# Altium project Surf_RF_transceiver.PrjPcb
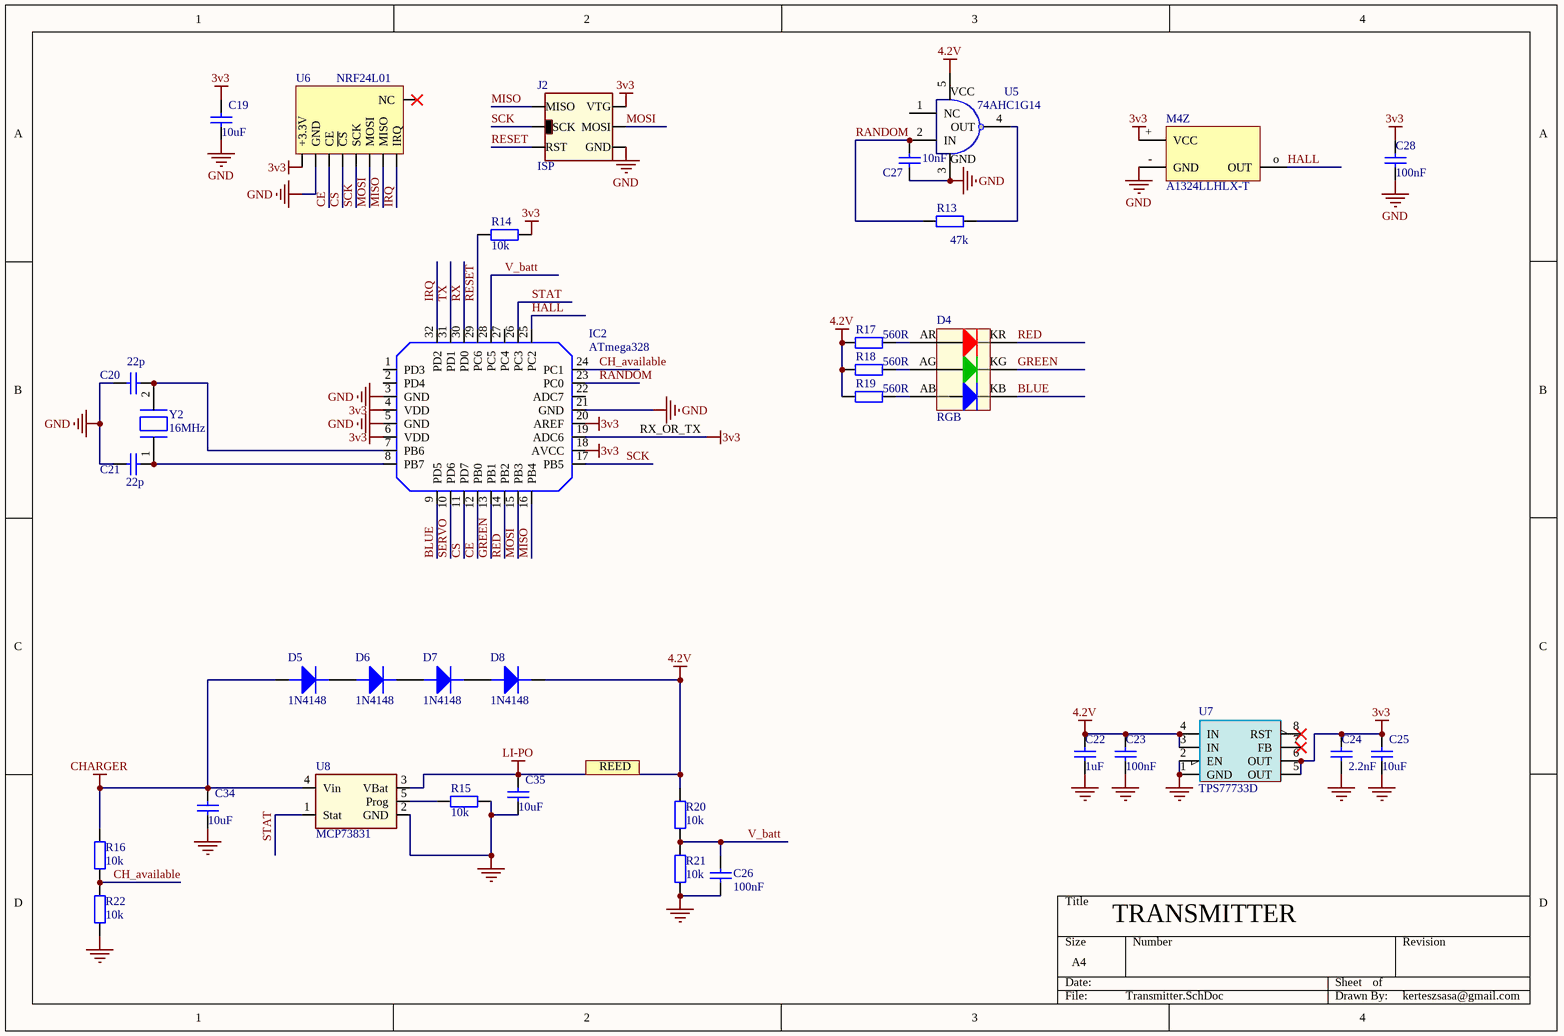
[diagram p0: Transmitter.SchDoc]
2 sheets, 76 parts. Net scope: global (net labels, ports and power ports of the same name join across sheets).
Board file: Surf_RF_transceiver.PcbDoc
Sheets:
  Transmitter.SchDoc
  Receiver.SchDoc

## Sheet Transmitter.SchDoc
size A4

### Parts
C19  10uF  [FP_0603_CAP_080]
C20  22p  [FP_0603_CAP_080]
C21  22p  [FP_0603_CAP_080]
C22  1uF  [FP_0603_CAP_080]
C23  100nF  [FP_0603_CAP_080]
C24  2.2nF  [FP_0603_CAP_080]
C25  10uF  [FP_0603_CAP_080]
C26  100nF  [FP_0603_CAP_080]
C27  10nF  [FP_0603_CAP_080]
C28  100nF  [FP_0603_CAP_080]
C34  10uF  [FP_0603_CAP_080]
C35  10uF  [FP_0603_CAP_080]
D4  RGB  [RGB_LED_5.0x5.0mm]
D5  1N4148  [SOD-80]
D6  1N4148  [SOD-80]
D7  1N4148  [SOD-80]
D8  1N4148  [SOD-80]
IC2  ATmega328  [TQFP32_N]
J2  ISP  [AVR_ISP]  (no BOM)
M4Z  A1324LLHLX-T  [Sensoe_hall_SOT23]
R13  47k  [FP_0603_RES]
R14  10k  [FP_0603_RES]
R15  10k  [FP_0603_RES]
R16  10k  [FP_0603_RES]
R17  560R  [FP_0603_RES]
R18  560R  [FP_0603_RES]
R19  560R  [FP_0603_RES]
R20  10k  [FP_0603_RES]
R21  10k  [FP_0603_RES]
R22  10k  [FP_0603_RES]
U5  74AHC1G14  [GATE_SOT23-5]
U6  NRF24L01  [NRF24L01_SMD]
U7  TPS77733D  [DIGITAL_SOIC8]
U8  MCP73831  [SUPPLY_SOT23-5]
Y2  16MHz  [FP_CRYSTAL_HC49_SMD]

### Nets
3v3: C19.2 C24.2 C25.2 C28.2 IC2.4(VDD) IC2.6(VDD) IC2.18(AVCC) IC2.19(ADC6) IC2.20(AREF) J2.2(VTG) M4Z.+(VCC) R14.2 U6.1(+3.3V) U7.5(OUT) U7.6(OUT)
4.2V: C22.2 C23.2 D8.K R17.2 R18.2 R19.2 R20.2 U5.5(VCC) U7.3(IN) U7.4(IN)
CHARGER: C34.2 D5.A R16.2 U8.4(Vin)
GND: C19.1 C20.1 C21.1 C22.1 C23.1 C24.1 C25.1 C26.2 C27.1 C28.1 C34.1 C35.1 IC2.3(GND) IC2.5(GND) IC2.21(GND) J2.6(GND) M4Z.-(GND) R15.1 R21.1 R22.1 U5.3(GND) U6.2(GND) U7.1(GND) U7.2(EN) U8.2(GND)
LI-PO: C35.2 U8.3(VBat)
BLUE: D4.KB(R) IC2.9(PD5)
CE: IC2.12(PB0) U6.3(CE)
CH_available: IC2.24(PC1) R16.1 R22.2
CS: IC2.11(PD7) U6.4(~{CS})
GREEN: D4.KG(G) IC2.13(PB1)
HALL: IC2.25(PC2) M4Z.o(OUT)
IRQ: IC2.32(PD2) U6.8(IRQ)
MISO: IC2.16(PB4) J2.1(MISO) U6.7(MISO)
MOSI: IC2.15(PB3) J2.4(MOSI) U6.6(MOSI)
RANDOM: C27.2 IC2.23(PC0) R13.2 U5.2(IN)
RED: D4.KR(B) IC2.14(PB2)
RESET: IC2.29(PC6) J2.5(RST) R14.1
RX: IC2.30(PD0)
SCK: IC2.17(PB5) J2.3(SCK) U6.5(SCK)
SERVO: IC2.10(PD6)
STAT: IC2.26(PC3) U8.1(Stat)
TX: IC2.31(PD1)
V_batt: C26.1 IC2.28(PC5) R20.1 R21.2
NetC20_2: C20.2 IC2.7(PB6) Y2.2
NetC21_2: C21.2 IC2.8(PB7) Y2.1
NetD4_AB: D4.AB(A) R19.1
NetD4_AG: D4.AG(A) R18.1
NetD4_AR: D4.AR(A) R17.1
NetD5_K: D5.K D6.A
NetD6_K: D6.K D7.A
NetD7_K: D7.K D8.A
NetR13_1: R13.1 U5.4(OUT)
NetR15_2: R15.2 U8.5(Prog)

Not connected (* = marked no-connect by the designer): IC2 1(PD3) 2(PD4) 22(ADC7) 27(PC4); U5 1(NC); U6 9(NC)*; U7 7(FB)* 8(RST)*

### Notes on the sheet
- RX_OR_TX
- REED
- TRANSMITTER
- kerteszsasa@gmail.com

### Library data of the parts
C19-C28 C34 C35 = Cap: Capacitor; Leírás: Capacitor ceramic X7R
  C19 C25 C34 C35: Value: 10uF; Order info: 82-07-81
  C20 C21: Value: 22p; Order info: 82-02-18
  C22: Order info: 82-08-08; Value: 1uF
  C23 C28: Value: 100nF; Order info: 82-04-85
  C24: Value: 2.2nF; Order info: 82-02-41
  C26: Value: 100nF; Order info: 82-06-23
  C27: Value: 10nF; Order info: 82-07-81
D4 = LED_RGB_6_PIN: Leírás: RGB led; Order info: 95-02-90
D5-D8 = DIODE_big: Diode 1N4148 SMD; Order info: 83-01-06; Leírás: Diode 1N4148 SMD
J2 = ISP: Programozó csatlakozó; Order info: nem kell; Leírás: Programozó csatlakozó
M4Z = A3122EUA: Hall-Effect Switch for High-Temperature Operation; Leírás: HALL sensor; Order info: http://hu.mouser.com/ProductDetail/Texas-Instruments/DRV5053RAQDBZRQ1/?qs=sGAEpiMZZMvhQj7WZhFIAKr4ZLpH%2fvGa8o%2fNpWWMhmTwb2ZevLC2RA%3d%3d
R13-R22 = Res3: Resistor; Leírás: Resistor
  R13: Value: 47k; Order info: 81-10-46
  R14-R16 R20-R22: Value: 10k; Order info: 80-11-68
  R17-R19: Value: 560R; Order info: 81-04-19
U5 = 74AHC1G14: SCHMITT-TRIGGER INVERTER; Leírás: Inverter gate; Order info: 87-03-90
U6 = NRF24L01: 2.4Ghz RF module; Leírás: 2.4GHz RF module; Order info: http://www.ebay.com/itm/Mini-NRF24L01-SMD-1-27MM-wireless-transceiver-module-Small-Size/321938267213?_trksid=p2047675.c100005.m1851&_trkparms=aid%3D222007%26algo%3DSIC.MBE%26ao%3D1%26asc%3D20131003132420%26meid%3D79cec08809324ce588edcca11bd960b9%26pid%3D100005%26rk%3D2%26rkt%3D6%26sd%3D131725655413
U7 = TPS77733D: LDO Voltage Regulators Fast-Tran-Res 750-mA; Order info: http://hu.mouser.com/ProductDetail/Texas-Instruments/TPS77733D/?qs=sGAEpiMZZMsGz1a6aV8DcPXeWoVS0FnzzBFSSaOk9hM%3d; Leírás: LDO Voltage Regulators Fast-Tran-Res 750-mA
U8 = MCP73831: MCP73831 SOT23-5 Li-on batt charger; Leírás: LIPO charger; Order info: http://hu.mouser.com/ProductDetail/Microchip-Technology/MCP73831T-2ACI-OT/?qs=sGAEpiMZZMsfD%252bbMpEGFJbfJoD52oiVFLoHG0qn9uiA%3d
Y2 = XTAL HC49: Standard HC49 quartz; Leírás: 16MHz Quartz HC49; Value: 16MHz; Order info: 40-01-26
IC2 = ATmega328: Order info: http://hu.mouser.com/Semiconductors/Embedded-Processors-Controllers/Microcontrollers-MCU/8-bit-Microcontrollers-MCU/_/N-a85ik?P=1z0y146&Keyword=atmega328&FS=True&Ns=Pricing|0; Leírás: ATmega328

## Sheet Receiver.SchDoc
size A4
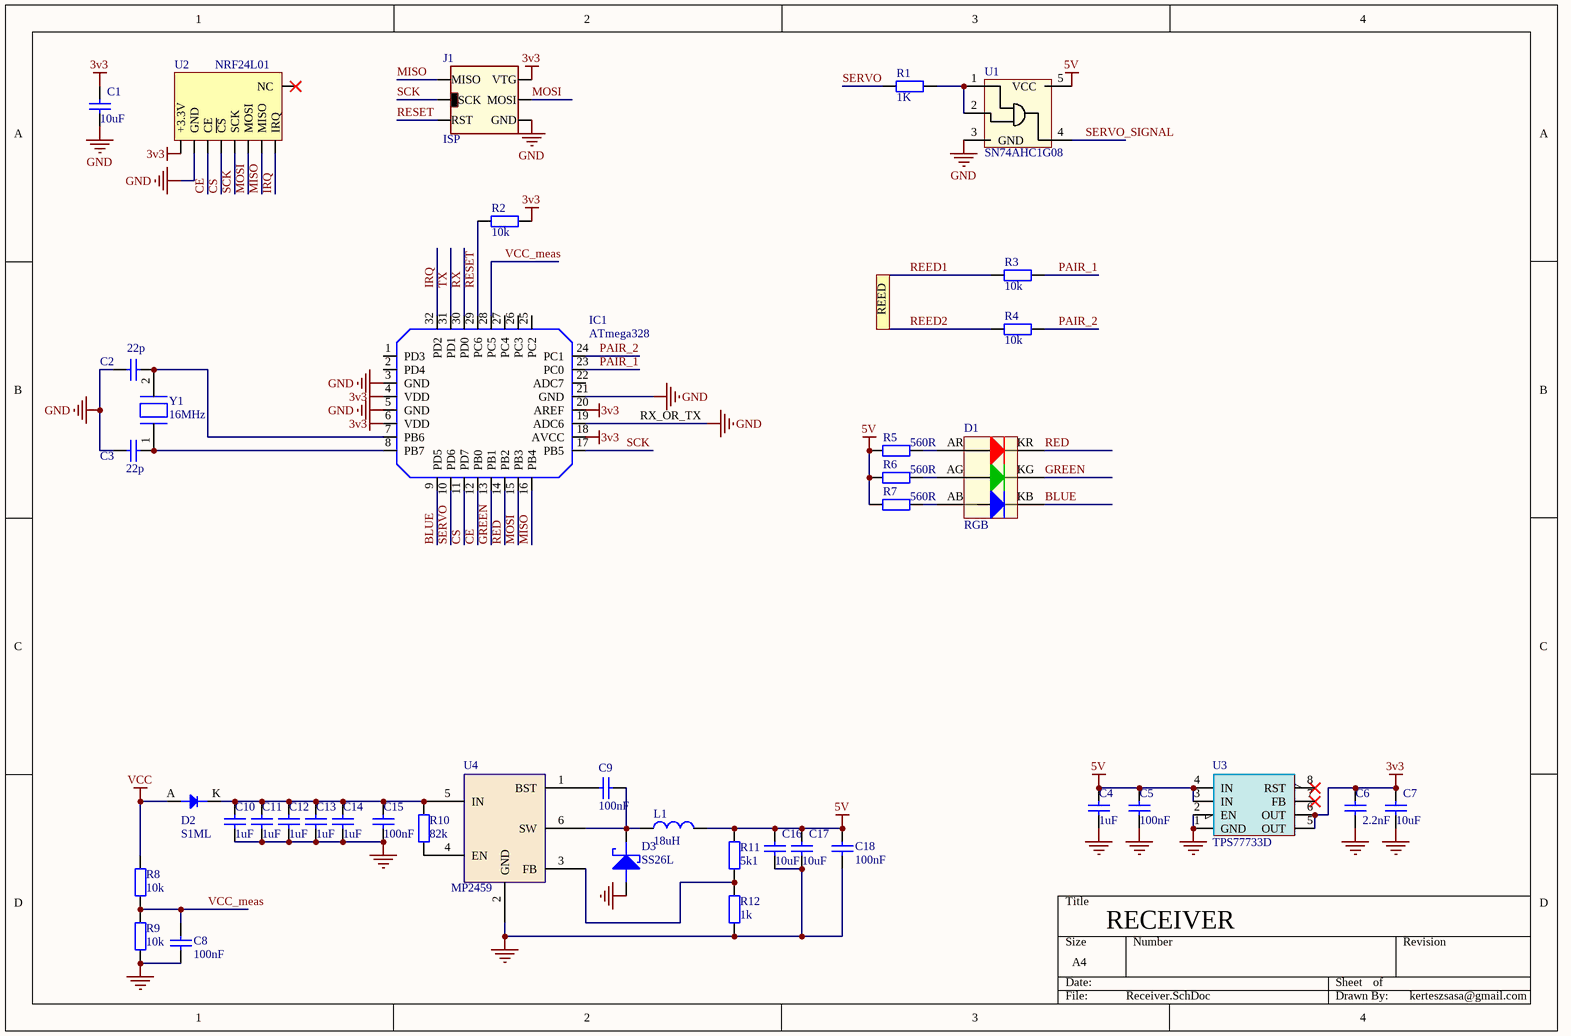
[diagram p1: Receiver.SchDoc]

### Parts
C1  10uF  [FP_0603_CAP_080]
C2  22p  [FP_0603_CAP_080]
C3  22p  [FP_0603_CAP_080]
C4  1uF  [FP_0603_CAP_080]
C5  100nF  [FP_0603_CAP_080]
C6  2.2nF  [FP_0603_CAP_080]
C7  10uF  [FP_0603_CAP_080]
C8  100nF  [FP_0603_CAP_080]
C9  100nF  [FP_0603_CAP_080]
C10  1uF  [FP_0805_CAP_145]
C11  1uF  [FP_0805_CAP_145]
C12  1uF  [FP_0805_CAP_145]
C13  1uF  [FP_0805_CAP_145]
C14  1uF  [FP_0805_CAP_145]
C15  100nF  [FP_0603_CAP_080]
C16  10uF  [FP_0603_CAP_080]
C17  10uF  [FP_0603_CAP_080]
C18  100nF  [FP_0603_CAP_080]
D1  RGB  [RGB_LED_5.0x5.0mm]
D2  S1ML  [subsma]
D3  SS26L  [subsma]
IC1  ATmega328  [TQFP32_N]
J1  ISP  [AVR_ISP]  (no BOM)
L1  18uH  [SDR0403_IND_4.5x5mm]
R1  1K  [FP_0603_RES]
R2  10k  [FP_0603_RES]
R3  10k  [FP_0603_RES]
R4  10k  [FP_0603_RES]
R5  560R  [FP_0603_RES]
R6  560R  [FP_0603_RES]
R7  560R  [FP_0603_RES]
R8  10k  [FP_0603_RES]
R9  10k  [FP_0603_RES]
R10  82k  [FP_0603_RES]
R11  5k1  [FP_0603_RES]
R12  1k  [FP_0603_RES]
U1  SN74AHC1G08  [GATE_SOT23-5]
U2  NRF24L01  [NRF24L01_SMD]
U3  TPS77733D  [DIGITAL_SOIC8]
U4  MP2459  [Supply_SOT23-6]
Y1  16MHz  [FP_CRYSTAL_HC49_SMD]

### Nets
3v3: C1.2 C6.2 C7.2 IC1.4(VDD) IC1.6(VDD) IC1.18(AVCC) IC1.20(AREF) J1.2(VTG) R2.2 U2.1(+3.3V) U3.5(OUT) U3.6(OUT)
5V: C4.2 C5.2 C16.2 C17.2 C18.1 L1.2 R5.2 R6.2 R7.2 R11.1 U1.5(VCC) U3.3(IN) U3.4(IN)
GND: C1.1 C2.1 C3.1 C4.1 C5.1 C6.1 C7.1 C8.2 C10.1 C11.1 C12.1 C13.1 C14.1 C15.2 C16.1 C17.1 C18.2 D3.A IC1.3(GND) IC1.5(GND) IC1.19(ADC6) IC1.21(GND) J1.6(GND) R9.1 R12.2 U1.3(GND) U2.2(GND) U3.1(GND) U3.2(EN) U4.2(GND)
VCC: D2.A R8.2
BLUE: D1.KB(R) IC1.9(PD5)
CE: IC1.12(PB0) U2.3(CE)
CS: IC1.11(PD7) U2.4(~{CS})
GREEN: D1.KG(G) IC1.13(PB1)
IRQ: IC1.32(PD2) U2.8(IRQ)
MISO: IC1.16(PB4) J1.1(MISO) U2.7(MISO)
MOSI: IC1.15(PB3) J1.4(MOSI) U2.6(MOSI)
PAIR_1: IC1.23(PC0) R3.2
PAIR_2: IC1.24(PC1) R4.2
RED: D1.KR(B) IC1.14(PB2)
REED1: R3.1
REED2: R4.1
RESET: IC1.29(PC6) J1.5(RST) R2.1
RX: IC1.30(PD0)
SCK: IC1.17(PB5) J1.3(SCK) U2.5(SCK)
SERVO: IC1.10(PD6) R1.1
SERVO_SIGNAL: U1.4(Y)
TX: IC1.31(PD1)
VCC_meas: C8.1 IC1.28(PC5) R8.1 R9.2
NetC2_2: C2.2 IC1.7(PB6) Y1.2
NetC3_2: C3.2 IC1.8(PB7) Y1.1
NetC9_1: C9.1 D3.K L1.1 U4.6(SW)
NetC9_2: C9.2 U4.1(BST)
NetC10_2: C10.2 C11.2 C12.2 C13.2 C14.2 C15.1 D2.K R10.1 U4.5(IN)
NetD1_AB: D1.AB(A) R7.1
NetD1_AG: D1.AG(A) R6.1
NetD1_AR: D1.AR(A) R5.1
NetR1_2: R1.2 U1.1(A) U1.2(B)
NetR10_2: R10.2 U4.4(EN)
NetR11_2: R11.2 R12.1 U4.3(FB)

Not connected (* = marked no-connect by the designer): IC1 1(PD3) 2(PD4) 22(ADC7) 25(PC2) 26(PC3) 27(PC4); U2 9(NC)*; U3 7(FB)* 8(RST)*

### Notes on the sheet
- REED
- RX_OR_TX
- RECEIVER
- kerteszsasa@gmail.com

### Library data of the parts
C1-C9 C15-C18 = Cap: Capacitor; Leírás: Capacitor ceramic X7R
  C1 C7 C16 C17: Value: 10uF; Order info: 82-07-81
  C2 C3: Value: 22p; Order info: 82-02-18
  C4: Order info: 82-08-08; Value: 1uF
  C5: Value: 100nF; Order info: 82-04-85
  C6: Value: 2.2nF; Order info: 82-02-41
  C8 C9 C15 C18: Value: 100nF; Order info: 82-06-23
C10-C14 = CAP: Capacitor; Leírás: Capacitor ceramic X7R; Value: 1uF; Order info: 82-07-84
D1 = LED_RGB_6_PIN: Leírás: RGB led; Order info: 95-02-90
D2 = DIODE: Order info: 83-00-35; Leírás: Diode
D3 = SCHOTTKY: NXP - PMEG3020EJ,115 - SCHOTTKY RECT 30V 2A SOD323F; Leírás: Diode; Order info: 83-02-21
J1 = ISP: as J2 on sheet Transmitter; Leírás: Programozó csatlakozó
L1 = L: Inductor; Order info: http://hu.mouser.com/ProductDetail/Bourns/SDR0403-180ML/?qs=%2fha2pyFadugaUgAfXzcwcLna1ckgYO6S0a7jYHnPAq4GNedMqyioAg%3d%3d; Leírás: Inductor
R1 R10 = RES: Resistor; Leírás: Resistor
  R1: Value: 1K; Order info: 80-11-59
  R10: Value: 82k; Order info: 81-10-49
R2-R9 R11 R12 = Res3: Resistor; Leírás: Resistor
  R2-R4 R8 R9: Value: 10k; Order info: 80-11-68
  R5-R7: Value: 560R; Order info: 81-04-19
  R11: Value: 5k1; Order info: 80-11-67
  R12: Value: 1k; Order info: 80-11-59
U1 = SN74AHC1G08: 1x2-INPUT AND-GATE; Leírás: AND-GATE 1x2-INPUT; Order info: 87-02-78
U2 = NRF24L01: 2.4Ghz RF module; Leírás: 2.4GHz RF module; Order info: http://www.ebay.com/itm/Mini-NRF24L01-SMD-1-27MM-wireless-transceiver-module-Small-Size/321938267213?_trksid=p2047675.c100005.m1851&_trkparms=aid%3D222007%26algo%3DSIC.MBE%26ao%3D1%26asc%3D20131003132420%26meid%3D79cec08809324ce588edcca11bd960b9%26pid%3D100005%26rk%3D2%26rkt%3D6%26sd%3D131725655413
U3 = TPS77733D: as U7 on sheet Transmitter; Order info: http://hu.mouser.com/ProductDetail/Texas-Instruments/TPS77733D/?qs=sGAEpiMZZMsGz1a6aV8DcPXeWoVS0FnzzBFSSaOk9hM%3d; Leírás: LDO Voltage Regulators Fast-Tran-Res 750-mA
U4 = MP2459: 0.5A, 55V, 480kHz  Step-Down Converter in a TSOT23-6; Leírás: DC-DC converter; Order info: http://hu.mouser.com/ProductDetail/Monolithic-Power-Systems-MPS/MP2459GJ-Z/?qs=sGAEpiMZZMtitjHzVIkrqWVTGjLJY%2f0AdgGEc3azCiA%3d
Y1 = XTAL HC49: as Y2 on sheet Transmitter; Value: 16MHz; Order info: 40-01-26
IC1 = ATmega328: Order info: http://hu.mouser.com/Semiconductors/Embedded-Processors-Controllers/Microcontrollers-MCU/8-bit-Microcontrollers-MCU/_/N-a85ik?P=1z0y146&Keyword=atmega328&FS=True&Ns=Pricing|0; Leírás: ATmega328

## Nets that join several sheets
3v3: Transmitter (15 pins), Receiver (12 pins)
GND: Transmitter (25 pins), Receiver (30 pins)
BLUE: Transmitter (D4.KB IC2.9), Receiver (D1.KB IC1.9)
CE: Transmitter (IC2.12 U6.3), Receiver (IC1.12 U2.3)
CS: Transmitter (IC2.11 U6.4), Receiver (IC1.11 U2.4)
GREEN: Transmitter (D4.KG IC2.13), Receiver (D1.KG IC1.13)
IRQ: Transmitter (IC2.32 U6.8), Receiver (IC1.32 U2.8)
MISO: Transmitter (IC2.16 J2.1 U6.7), Receiver (IC1.16 J1.1 U2.7)
MOSI: Transmitter (IC2.15 J2.4 U6.6), Receiver (IC1.15 J1.4 U2.6)
RED: Transmitter (D4.KR IC2.14), Receiver (D1.KR IC1.14)
RESET: Transmitter (IC2.29 J2.5 R14.1), Receiver (IC1.29 J1.5 R2.1)
RX: Transmitter (IC2.30), Receiver (IC1.30)
SCK: Transmitter (IC2.17 J2.3 U6.5), Receiver (IC1.17 J1.3 U2.5)
SERVO: Transmitter (IC2.10), Receiver (IC1.10 R1.1)
TX: Transmitter (IC2.31), Receiver (IC1.31)